# EAGLE schematic transistores (EAGLE 9.6.2)
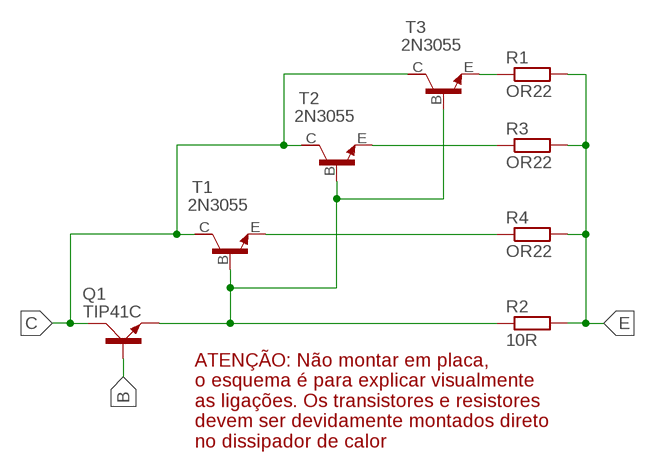
[diagram p0: schematic, sheet 1]

## Parts
Q1  TIP41C  [TO220AV]
R1  OR22  R-EU_0922/22  [0922/22]
R2  10R  R-EU_0922/22  [0922/22]
R3  OR22  R-EU_0922/22  [0922/22]
R4  OR22  R-EU_0922/22  [0922/22]
T1  2N3055  [TO3]
T2  2N3055  [TO3]
T3  2N3055  [TO3]

## Nets
B: Q1.B
C: Q1.C T1.C T2.C T3.C
E: R1.2 R2.2 R3.2 R4.2
N$1: Q1.E R2.1 T1.B T2.B T3.B
N$2: R1.1 T3.E
N$3: R3.1 T2.E
N$4: R4.1 T1.E
Unconnected: T1.C/(C) T2.C/(C) T3.C/(C)

## Notes on the sheet
- ATENÇÃO: Não montar em placa,
  o esquema é para explicar visualmente
  as ligações. Os transistores e resistores
  devem ser devidamente montados direto
  no dissipador de calor

## Library data of the parts
Q1 = transistor-power:TIP41C: NPN TRANSISTOR
R1-R4 = resistor:R-EU_: RESISTOR, European symbol
T1-T3 = transistor-neu-to92:2N3055: NPN TRANSISTOR